# Altium project btalti.PrjPCB
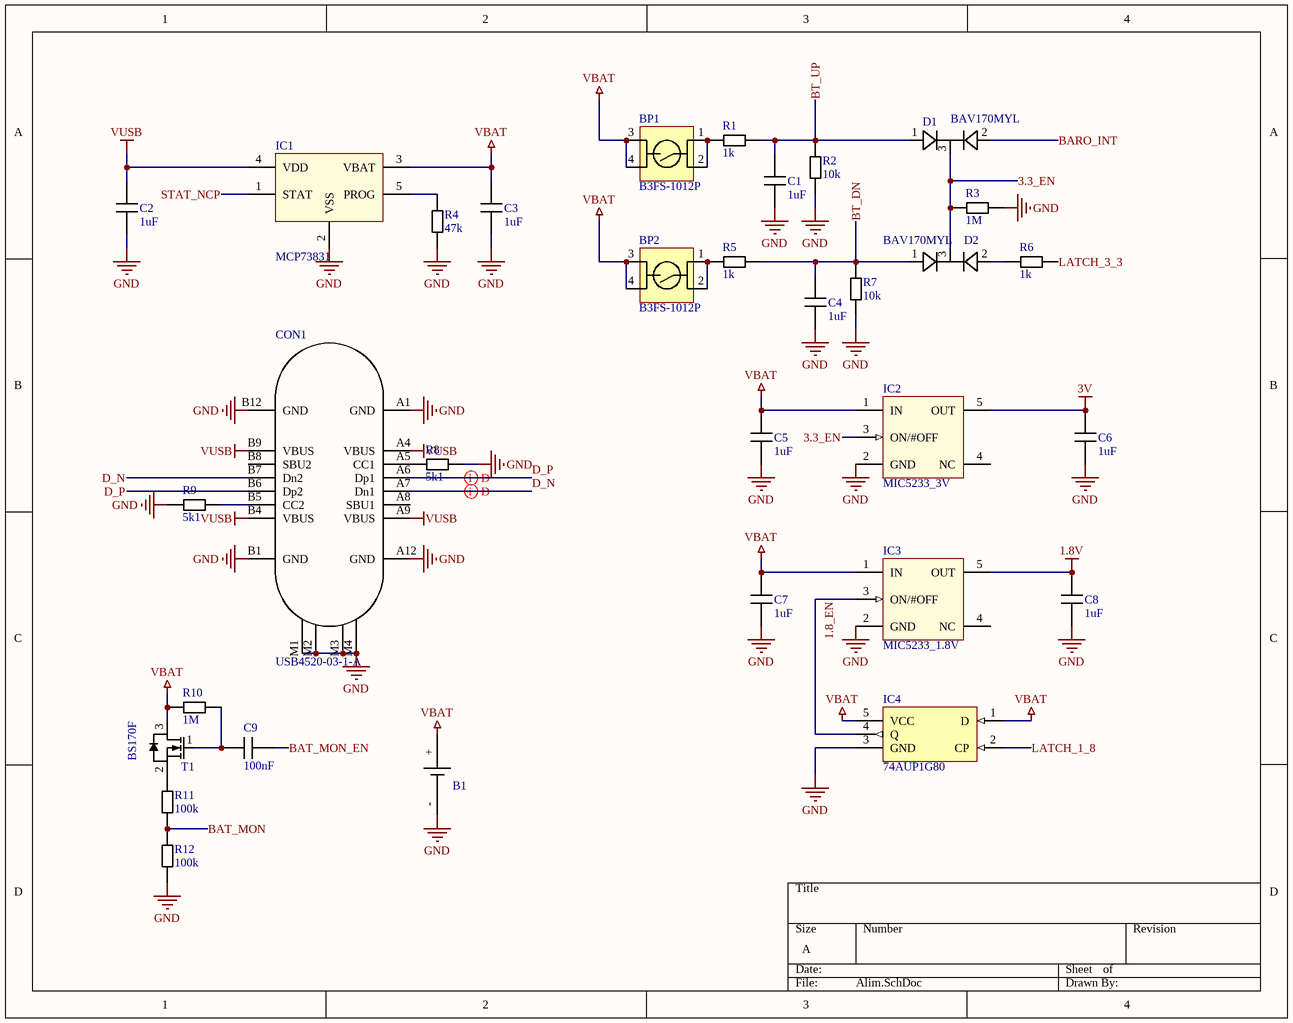
[diagram p0: Alim.SchDoc]
5 sheets, 99 parts. Net scope: global (net labels, ports and power ports of the same name join across sheets).
Board file: BT_ALTI.PcbDoc
Sheets:
  Alim.SchDoc
  Micro.SchDoc
  beep.SchDoc
  baro.SchDoc
  epd.SchDoc

## Sheet Alim.SchDoc
size A; SheetNumber: 1; SheetTotal: 3

### Parts
B1  EC382704P-T  [EC382704P-T]  (value not drawn)
BP1  B3FS-1012P  [B3FS]
BP2  B3FS-1012P  [B3FS]
C1  value 1uF  [C0402]  (hidden comment: 1uF (0402) AEC-Q200)
C2  value 1uF  [C0402]  (hidden comment: 1uF (0402) AEC-Q200)
C3  value 1uF  [C0402]  (hidden comment: 1uF (0402) AEC-Q200)
C4  value 1uF  [C0402]  (hidden comment: 1uF (0402) AEC-Q200)
C5  value 1uF  [C0402]  (hidden comment: 1uF (0402) AEC-Q200)
C6  value 1uF  [C0402]  (hidden comment: 1uF (0402) AEC-Q200)
C7  value 1uF  [C0402]  (hidden comment: 1uF (0402) AEC-Q200)
C8  value 1uF  [C0402]  (hidden comment: 1uF (0402) AEC-Q200)
C9  value 100nF  [C0402]  (hidden comment: 100nF (0402) AEC-Q200)
CON1  USB4520-03-1-A  [USB4520-03-1-A]
D1  BAV170MYL  [DFN1006-3]
D2  BAV170MYL  [DFN1006-3]
IC1  MCP73831  [SOT23-5]
IC2  MIC5233_3V  [SOT23-5]
IC3  MIC5233_1.8V  [SOT23-5]
IC4  74AUP1G80  [TSSOP5]
R1  value 1k  [R0402]  (hidden comment: 1k (0402))
R2  value 10k  [R0402]  (hidden comment: 10k (0402))
R3  value 1M  [R0402]  (hidden comment: 1M (0402))
R4  value 47k  [R0402]  (hidden comment: 47k (0402))
R5  value 1k  [R0402]  (hidden comment: 1k (0402))
R6  value 1k  [R0402]  (hidden comment: 1k (0402))
R7  value 10k  [R0402]  (hidden comment: 10k (0402))
R8  value 5k1  [R0402]  (hidden comment: 5k1 (0402) AEC-Q200)
R9  value 5k1  [R0402]  (hidden comment: 5k1 (0402) AEC-Q200)
R10  value 1M  [R0402]  (hidden comment: 1M (0402))
R11  value 100k  [R0402]  (hidden comment: 100k (0402))
R12  value 100k  [R0402]  (hidden comment: 100k (0402))
T1  BS170F  [SOT-23-3]

### Nets
1.8V: C8.1 IC3.5(OUT)
3V: C6.1 IC2.5(OUT)
GND: B1.- C1.2 C2.2 C3.2 C4.2 C5.2 C6.2 C7.2 C8.2 CON1.A1(GND) CON1.A12(GND) CON1.B1(GND) CON1.B12(GND) CON1.M1 CON1.M2 CON1.M3 CON1.M4 IC1.2(VSS) IC2.2(GND) IC3.2(GND) IC4.3(GND) R2.1 R3.1 R4.1 R7.1 R8.2 R9.1 R12.1
VBAT: B1.+ BP1.3 BP1.4 BP2.3 BP2.4 C3.1 C5.1 C7.1 IC1.3(VBAT) IC2.1(IN) IC3.1(IN) IC4.1(D) IC4.5(VCC) R10.1 T1.3(D)
VUSB: C2.1 CON1.A4(VBUS) CON1.A9(VBUS) CON1.B4(VBUS) CON1.B9(VBUS) IC1.4(VDD)
3.3_EN: D1.3(K1/A2) D2.3(K1/A2) IC2.3(ON/#OFF) R3.2
BARO_INT: D1.2(K2)
BAT_MON: R11.1 R12.2
BAT_MON_EN: C9.1
BT_DN: C4.1 D2.1(A1) R5.2 R7.2
BT_UP: C1.1 D1.1(A1) R1.2 R2.2
D_N: CON1.A7(Dn1) CON1.B7(Dn2)
D_P: CON1.A6(Dp1) CON1.B6(Dp2)
LATCH_1_8: IC4.2(CP)
LATCH_3_3: R6.2
STAT_NCP: IC1.1(STAT)
NetBP1_1: BP1.1 BP1.2 R1.1
NetBP2_1: BP2.1 BP2.2 R5.1
NetC9_2: C9.2 R10.2 T1.1(G)
NetCON1_A5: CON1.A5(CC1) R8.1
NetCON1_B5: CON1.B5(CC2) R9.2
NetD2_2: D2.2(K2) R6.1
NetIC1_5: IC1.5(PROG) R4.2
NetIC3_3: IC3.3(ON/#OFF) IC4.4(Q)
NetR11_2: R11.2 T1.2(S)

Not connected (* = marked no-connect by the designer): CON1 A8(SBU1) B8(SBU2); IC2 4(NC); IC3 4(NC)

### Layout directives
differential pair: D_N, D_P

### Notes on the sheet
- Labels drawn without touching a wire or pin: 1.8_EN

### Library data of the parts
B1 = EC382704P-T: 2.3V 25mAh Li-ion; Fabricant: NGH; Référence: EC382704P-T; Value: EC382704P-T
BP1 BP2 = B3FS-1012P: Fabricant: Omron; Référence: B3FS-1012P; Value: B3FS-1012P
C1-C8 = 1uF (0402) AEC-Q200: X7S 10% 0402 10V AEC-Q200; Fabricant: Murata; Référence: GCM155C71A105KE38D
C9 = 100nF (0402) AEC-Q200: X7R 0402 10% 50V AEC-Q200; Référence: GCM155R71H104KE02J; Fabricant: MURATA
CON1 = USB4520-03-1-A: Connecteur USB-C Receptacke mid PCB; Fabricant: GCT; Référence: USB4520-03-1-A; Value: USB4520-03-1-A
D1 D2 = BAV170MYL: Diodes - General Purpose, Power, Switching BAV170M/SOT883/XQFN3; Fabricant: Nexperia; Référence: BAV170MYL; Value: BAV170MYL
IC1 = MCP73831: Chargeur Li-Ion/Li-Polymer; Référence: MCP73831T-2ACI/OT; Fabricant: *; Value: MCP73831
IC2 = MIC5233_3V: 3V || SOT23 || 100mA || IN : 2.3V to 36V; Fabricant: Microchip Technology; Référence: MIC5233-3.0YM5-TR; Value: MIC5233_3V
IC3 = MIC5233_1.8V: 1.8V || SOT23 || 100mA || IN : 2.3V to 36V; Fabricant: Microchip Technology; Référence: MIC5233-1.8YM5-TR; Value: MIC5233_1.8V
IC4 = 74AUP1G80: Low-power D-type flip-flop; positive-edge trigger TSSOP5; Fabricant: NEXPERIA; Référence: 74AUP1G80GW; Value: 74AUP1G80
R1 R5 R6 = 1k (0402): 1% 0402 0.063W 100ppm; Fabricant: MULTICOMP; Référence: MCWR04X1001FTL
R2 R7 = 10k (0402): 1% 0402 0.063W 100ppm; Référence: MCWR04X1002FTL; Fabricant: MULTICOMP
R3 R10 = 1M (0402): 1% 0402 0.063W 100ppm; Fabricant: MULTICOMP; Référence: MCWR04X1004FTL
R4 = 47k (0402): 1% 0402 0.063W 100ppm; Fabricant: MULTICOMP; Référence: MCWR04X4702FTL
R8 R9 = 5k1 (0402) AEC-Q200: 1% 0402 0.1W 100ppm AEC-Q200; Référence: ERJ-2RKF5101X; Fabricant: PANASONIC
R11 R12 = 100k (0402): 1% 0402  0.063W 100ppm; Fabricant: MULTICOMP; Référence: MCWR04X1003FTL
T1 = BS170F: N-MOS || SOT23 60V 150mA; Fabricant: Diodes Inc.; Référence: BS170F; Supplier: Farnell; RefSupplier: 9526005; Value: BS170F

## Sheet Micro.SchDoc
size A; SheetNumber: 2; SheetTotal: 3
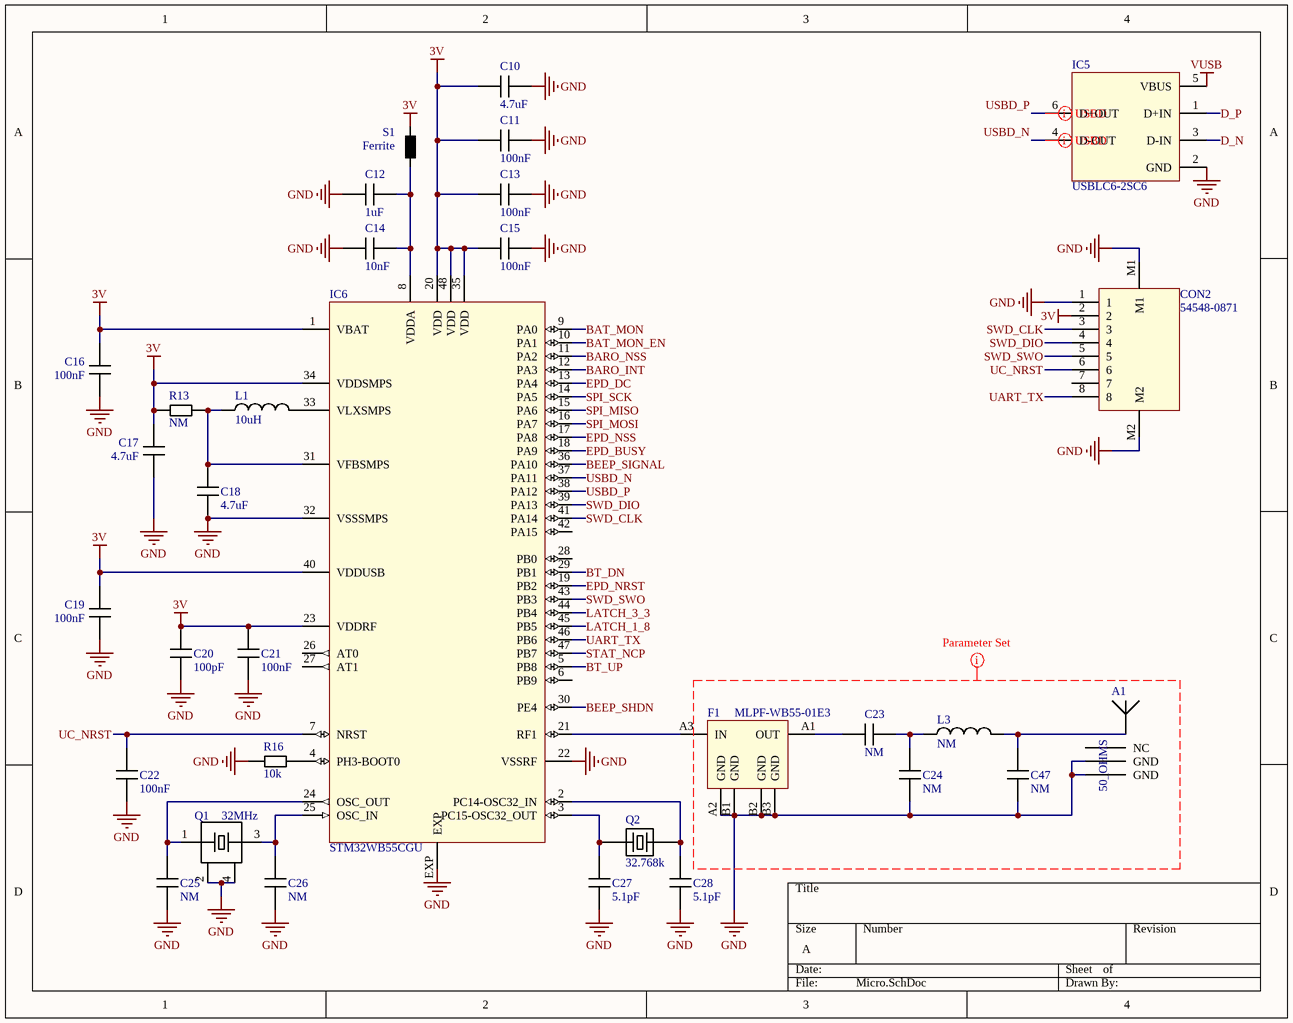
[diagram p1: Micro.SchDoc]

### Parts
A1  value 50_OHMS  [2450AT42E0100]  (hidden comment: 2450AT42E0100)
C10  value 4.7uF  [C0402]  (hidden comment: 4.7uF (0402) AEC-Q200)
C11  value 100nF  [C0402]  (hidden comment: 100nF (0402) AEC-Q200)
C12  value 1uF  [C0402]  (hidden comment: 1uF (0402))
C13  value 100nF  [C0402]  (hidden comment: 100nF (0402) AEC-Q200)
C14  value 10nF  [C0402]  (hidden comment: 10nF (0402) AEC-Q200)
C15  value 100nF  [C0402]  (hidden comment: 100nF (0402) AEC-Q200)
C16  value 100nF  [C0402]  (hidden comment: 100nF (0402) AEC-Q200)
C17  value 4.7uF  [C0402]  (hidden comment: 4.7uF (0402) AEC-Q200)
C18  value 4.7uF  [C0402]  (hidden comment: 4.7uF (0402) AEC-Q200)
C19  value 100nF  [C0402]  (hidden comment: 100nF (0402) AEC-Q200)
C20  value 100pF  [C0402]  (hidden comment: 100pF (0402) AEC-Q200)
C21  value 100nF  [C0402]  (hidden comment: 100nF (0402) AEC-Q200)
C22  value 100nF  [C0402]  (hidden comment: 100nF (0402) AEC-Q200)
C23  value NM  [C0402 (NM)]  (hidden comment: NM (0402))
C24  value NM  [C0402 (NM)]  (hidden comment: NM (0402))
C25  value NM  [C0402 (NM)]  (hidden comment: NM (0402))
C26  value NM  [C0402 (NM)]  (hidden comment: NM (0402))
C27  value 5.1pF  [C0402]  (hidden comment: 5.1pF (0402) AEC-Q200)
C28  value 5.1pF  [C0402]  (hidden comment: 5.1pF (0402) AEC-Q200)
C47  value NM  [C0402 (NM)]  (hidden comment: NM (0402))
CON2  54548-0871  [54548-0871]
F1  MLPF-WB55-01E3  [MLPF-WB-01E3]
IC5  value USBLC6-2SC6  [SOT23-6]  (hidden comment: USBLC6-2)
IC6  STM32WB55CGU  [UFQFPN48]
L1  value 10uH  [2.5x2 (2512)]  (hidden comment: 10uH (2.5x2) AEC-Q200)
L3  value NM  [S0402 (NM)]  (hidden comment: NM (0402))
Q1  value 32MHz  [2.0x1.6 - ECS-320-8-47Q]  (hidden comment: ECS-320-8-47Q-CES-TR)
Q2  value 32.768k  [3.2x1.5]  (hidden comment: ECS-.327-12.5-34QCS-TR)
R13  value NM  [R0402 (NM)]  (hidden comment: NM (0402))
R16  value 10k  [R0402]  (hidden comment: 10k (0402) AEC-Q200)
S1  value Ferrite  [0402 (FERRITE)]  (hidden comment: Ferrite (0402) 1k AEC-Q200)

### Nets
3V: C10.2 C11.1 C13.1 C15.1 C16.1 C17.2 C19.1 C20.1 C21.1 CON2.2 IC6.1(VBAT) IC6.20(VDD) IC6.23(VDDRF) IC6.34(VDDSMPS) IC6.35(VDD) IC6.40(VDDUSB) IC6.48(VDD) R13.1 S1.2
GND: A1.3(GND) A1.4(GND) C10.1 C11.2 C12.1 C13.2 C14.2 C15.2 C16.2 C17.1 C18.1 C19.2 C20.2 C21.2 C22.2 C24.2 C25.2 C26.2 C27.2 C28.2 C47.2 CON2.1 CON2.M1 CON2.M2 F1.A2(GND) F1.B1(GND) F1.B2(GND) F1.B3(GND) IC5.2(GND) IC6.22(VSSRF) IC6.32(VSSSMPS) IC6.EXP Q1.2 Q1.4 R16.1
VUSB: IC5.5(VBUS)
BARO_INT: IC6.12(PA3)
BARO_NSS: IC6.11(PA2)
BAT_MON: IC6.9(PA0)
BAT_MON_EN: IC6.10(PA1)
BEEP_SHDN: IC6.30(PE4)
BEEP_SIGNAL: IC6.36(PA10)
BT_DN: IC6.29(PB1)
BT_UP: IC6.5(PB8)
D_N: IC5.3(D-IN)
D_P: IC5.1(D+IN)
EPD_BUSY: IC6.18(PA9)
EPD_DC: IC6.13(PA4)
EPD_NRST: IC6.19(PB2)
EPD_NSS: IC6.17(PA8)
LATCH_1_8: IC6.45(PB5)
LATCH_3_3: IC6.44(PB4)
SPI_MISO: IC6.15(PA6)
SPI_MOSI: IC6.16(PA7)
SPI_SCK: IC6.14(PA5)
STAT_NCP: IC6.47(PB7)
SWD_CLK: CON2.3 IC6.41(PA14)
SWD_DIO: CON2.4 IC6.39(PA13)
SWD_SWO: CON2.5 IC6.43(PB3)
UART_TX: CON2.8 IC6.46(PB6)
UC_NRST: C22.1 CON2.6 IC6.7(NRST)
USBD_N: IC5.4(D-OUT) IC6.37(PA11)
USBD_P: IC5.6(D+OUT) IC6.38(PA12)
NetA1_1: A1.1 C47.1 L3.2
NetC12_2: C12.2 C14.1 IC6.8(VDDA) S1.1
NetC18_2: C18.2 IC6.31(VFBSMPS) L1.1 R13.2
NetC23_1: C23.1 F1.A1(OUT)
NetC23_2: C23.2 C24.1 L3.1
NetC25_1: C25.1 IC6.24(OSC_OUT) Q1.1(NC)
NetC26_1: C26.1 IC6.25(OSC_IN) Q1.3(GND)
NetC27_1: C27.1 IC6.3(PC15-OSC32_OUT) Q2.1
NetC28_1: C28.1 IC6.2(PC14-OSC32_IN) Q2.2
NetF1_A3: F1.A3(IN) IC6.21(RF1)
NetIC6_4: IC6.4(PH3-BOOT0) R16.2
NetIC6_33: IC6.33(VLXSMPS) L1.2

Not connected (* = marked no-connect by the designer): A1 2(NC); CON2 7; IC6 6(PB9) 26(AT0) 27(AT1) 28(PB0) 42(PA15)

### Layout directives
differential pair: USBD_N, USBD_P
net class RF; CompClassName: RF: (no net found under the mark)

### Library data of the parts
A1 = 2450AT42E0100: RF ANT 900MHZ HELICAL SOLDER SMD; Fabricant: PulseLarsen Antennas; Référence: 2450AT42E0100
C10 C17 C18 = 4.7uF (0402) AEC-Q200: X7T 0402 10% 6.3V AEC-Q200; Référence: KAM05CT70J475KH; Fabricant: KYOCERA AVX
C11 C13 C15 C16 C19 C21 C22 = 100nF (0402) AEC-Q200: as C9 on sheet Alim
C12 = 1uF (0402): X7S 10% 0402 16V; Fabricant: MURATA; Référence: GRM155C71C105KE11D
C14 = 10nF (0402) AEC-Q200: X7R 0402 10% 50V AEC-Q200; Fabricant: MURATA; Référence: GRT155R71H103KE01D
C20 = 100pF (0402) AEC-Q200: NP0 0402 5% 50V AEC-Q200; Référence: GCM1555C1H101JA16D; Fabricant: MURATA
C27 C28 = 5.1pF (0402) AEC-Q200: NP0 0402 5% 50V AEC-Q200; Fabricant: MURATA; Référence: GCM1555C1H5R1CA16D
CON2 = 54548-0871: Connecteur FFC/FPC, Right-Angle, Surface Mount, ZIF, Bottom Contact / Style, 30 Circuits; Fabricant: MOLEX; Référence: 54548-0871; Value: 54548-0871
F1 = MLPF-WB55-01E3: 2.4 GHz low pass filter matched to STM32WB55C; Fabricant: ST; Référence: MLPF-WB55-01E3; Value: MLPF-WB55-01E3
IC5 = USBLC6-2: Fabricant: ST; Référence: USBLC6-2SC6
IC6 = STM32WB55CGU: Fabricant: ST; Référence: STM32WB55CGU3; Value: STM32WB55CGU
L1 = 10uH (2.5x2) AEC-Q200: 20% 2.5x2 semi-blindé AEC-Q200; Fabricant: WURTH ELEKTRONIK; Référence: 74404024100; Supplier: Farnell; RefSupplier: 2431473
Q1 = ECS-320-8-47Q-CES-TR: Quartz 32MHz; Référence: ECS-320-10-37Q-ES-TR; Fabricant: ECS Inc.
Q2 = ECS-.327-12.5-34QCS-TR: Cristal, 32.768 kHz, CMS, 3.2mm x 1.5mm AEC-Q200; Fabricant: ECS; Référence: ECS-.327-12.5-34QCS-TR
R16 = 10k (0402) AEC-Q200: 1% 0402 0.1W 100ppm AEC-Q200; Référence: ERJ-2RKF1002X; Fabricant: PANASONIC
S1 = Ferrite (0402) 1k AEC-Q200: Perle de ferrite AEC-Q200; Fabricant: TDK; Référence: MMZ1005Y102CTD25

## Sheet beep.SchDoc
size A4
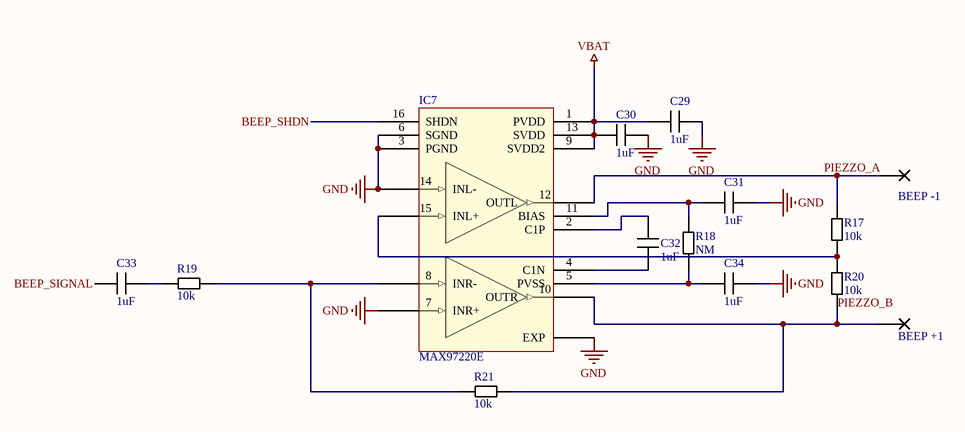
[diagram p2: beep.SchDoc]

### Parts
BEEP_+1  hole_0.8/0.5  [0.8 / 0.5]  (value not drawn)
BEEP_-1  hole_0.8/0.5  [0.8 / 0.5]  (value not drawn)
C29  value 1uF  [C0402]  (hidden comment: 1uF (0402))
C30  value 1uF  [C0402]  (hidden comment: 1uF (0402))
C31  value 1uF  [C0402]  (hidden comment: 1uF (0402))
C32  value 1uF  [C0402]  (hidden comment: 1uF (0402))
C33  value 1uF  [C0402]  (hidden comment: 1uF (0402))
C34  value 1uF  [C0402]  (hidden comment: 1uF (0402))
IC7  MAX97220E  [TQFN-16]
R17  value 10k  [R0402]  (hidden comment: 10k (0402))
R18  value NM  [R0402 (NM)]  (hidden comment: NM (0402))
R19  value 10k  [R0402]  (hidden comment: 10k (0402))
R20  value 10k  [R0402]  (hidden comment: 10k (0402))
R21  value 10k  [R0402]  (hidden comment: 10k (0402))

### Nets
GND: C29.2 C30.2 C31.2 C34.2 IC7.3(PGND) IC7.6(SGND) IC7.7(INR+) IC7.14(INL-) IC7.EXP
VBAT: C29.1 C30.1 IC7.1(PVDD) IC7.9(SVDD2) IC7.13(SVDD)
BEEP_SHDN: IC7.16(SHDN)
BEEP_SIGNAL: C33.1
PIEZZO_A: BEEP_-1.1 IC7.12(OUTL) R17.2
PIEZZO_B: BEEP_+1.1 IC7.10(OUTR) R20.1 R21.1
NetC31_1: C31.1 IC7.11(BIAS) R18.2
NetC32_1: C32.1 IC7.2(C1P)
NetC32_2: C32.2 IC7.4(C1N)
NetC33_2: C33.2 R19.2
NetC34_1: C34.1 IC7.5(PVSS) R18.1
NetIC7_8: IC7.8(INR-) R19.1 R21.2
NetIC7_15: IC7.15(INL+) R17.1 R20.2

### Library data of the parts
C29-C34 = 1uF (0402): as C12 on sheet Micro
IC7 = MAX97220E: Differential Input DirectDrive / Line Drivers/Headphone Amplifiers; Fabricant: Maxim Integrated; Value: MAX97220E; Référence: MAX97220E
R17 R19-R21 = 10k (0402): as R2 on sheet Alim
BEEP_+1 BEEP_-1 = hole_0.8/0.5: Value: *

## Sheet baro.SchDoc
size A4
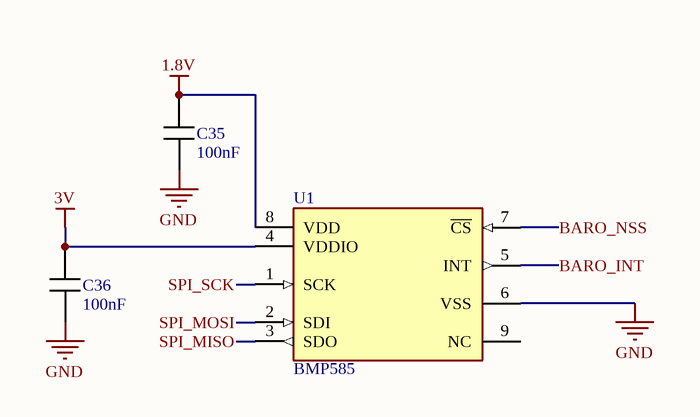
[diagram p3: baro.SchDoc]

### Parts
C35  value 100nF  [C0402]  (hidden comment: 100nF (0402) AEC-Q200)
C36  value 100nF  [C0402]  (hidden comment: 100nF (0402) AEC-Q200)
U1  BMP585  [BM585]

### Nets
1.8V: C35.2 U1.8(VDD)
3V: C36.2 U1.4(VDDIO)
GND: C35.1 C36.1 U1.6(VSS)
BARO_INT: U1.5(INT)
BARO_NSS: U1.7(~{CS})
SPI_MISO: U1.3(SDO)
SPI_MOSI: U1.2(SDI)
SPI_SCK: U1.1(SCK)

Not connected (* = marked no-connect by the designer): U1 9(NC)

### Library data of the parts
C35 C36 = 100nF (0402) AEC-Q200: as C9 on sheet Alim
U1 = BMP585: Absolute Pressure Sensor 1.65 to 3.6 V SPI -WFLGA-10; Fabricant: Bosch Sensortec; Value: BMP585; Référence: BMP585

## Sheet epd.SchDoc
size A; SheetNumber: 3; SheetTotal: 3
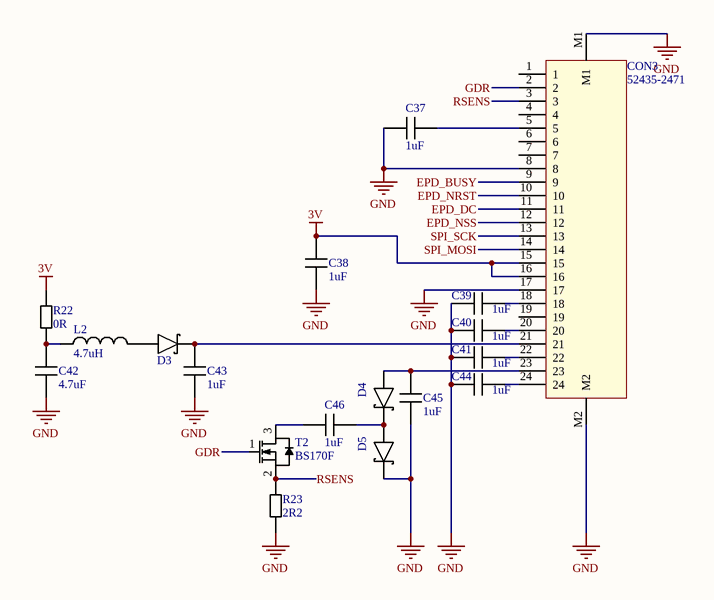
[diagram p4: epd.SchDoc]

### Parts
C37  value 1uF  [C0402]  (hidden comment: 1uF (0402) AEC-Q200 HT)
C38  value 1uF  [C0402]  (hidden comment: 1uF (0402) AEC-Q200 HT)
C39  value 1uF  [C0402]  (hidden comment: 1uF (0402) AEC-Q200 HT)
C40  value 1uF  [C0402]  (hidden comment: 1uF (0402) AEC-Q200 HT)
C41  value 1uF  [C0402]  (hidden comment: 1uF (0402) AEC-Q200 HT)
C42  value 4.7uF  [C0402]  (hidden comment: 4.7uF (0402) AEC-Q200)
C43  value 1uF  [C0402]  (hidden comment: 1uF (0402) AEC-Q200 HT)
C44  value 1uF  [C0402]  (hidden comment: 1uF (0402) AEC-Q200 HT)
C45  value 1uF  [C0402]  (hidden comment: 1uF (0402) AEC-Q200 HT)
C46  value 1uF  [C0402]  (hidden comment: 1uF (0402) AEC-Q200 HT)
CON3  52435-2471  [52435-2471]
D3  Schottky (0402) AEC-Q101  [SOD-882 (0402)]  (value not drawn)
D4  Schottky (0402) AEC-Q101  [SOD-882 (0402)]  (value not drawn)
D5  Schottky (0402) AEC-Q101  [SOD-882 (0402)]  (value not drawn)
L2  value 4.7uH  [S0603]  (hidden comment: 4.7uH (0603))
R22  value 0R  [R0402]  (hidden comment: 0R (0402) AEC-Q200)
R23  value 2R2  [R0402]  (hidden comment: 2R2 (0402))
T2  BS170F  [SOT-23-3]

### Nets
3V: C38.1 CON3.15 CON3.16 R22.2
GND: C37.1 C38.2 C39.2 C40.2 C41.2 C42.2 C43.2 C44.2 C45.2 CON3.8 CON3.17 CON3.M1 CON3.M2 D5.K R23.1
EPD_BUSY: CON3.9
EPD_DC: CON3.11
EPD_NRST: CON3.10
EPD_NSS: CON3.12
GDR: CON3.2 T2.1(G)
RSENS: CON3.3 R23.2 T2.2(S)
SPI_MOSI: CON3.14
SPI_SCK: CON3.13
NetC37_2: C37.2 CON3.5
NetC39_1: C39.1 CON3.18
NetC40_1: C40.1 CON3.20
NetC41_1: C41.1 CON3.22
NetC42_1: C42.1 L2.1 R22.1
NetC43_1: C43.1 CON3.21 D3.K
NetC44_1: C44.1 CON3.24
NetC45_1: C45.1 CON3.23 D4.A
NetC46_1: C46.1 T2.3(D)
NetC46_2: C46.2 D4.K D5.A
NetD3_A: D3.A L2.2

Not connected (* = marked no-connect by the designer): CON3 1 4 6 7 19

### Library data of the parts
C37-C41 C43-C46 = 1uF (0402) AEC-Q200 HT: X6S 10% 0402 25V AEC-Q200; Fabricant: Murata; Référence: GRT155C81E105KE13D
C42 = 4.7uF (0402) AEC-Q200: as C10 on sheet Micro
CON3 = 52435-2471: Connecteur FFC/FPC, Right-Angle, Surface Mount, ZIF, Top Contact / Style, 24 Circuits; Fabricant: MOLEX; Référence: 52435-2471; Value: 52435-2471
D3-D5 = Schottky (0402) AEC-Q101: 0402 40V 0.2A AEC-Q101; Fabricant: NEXPERIA; Référence: PMEG4002EL,315; Value: Schottky
L2 = 4.7uH (0603): 20% 0603 blindé; Fabricant: COILCRAFT; Référence: PFL1609-472MEU
R22 = 0R (0402) AEC-Q200: 0.1% 0402 0.1W AEC-Q200; Référence: ERJ-U020R00X; Fabricant: PANASONIC
R23 = 2R2 (0402): 1% 0402 0.1W 100ppm; Fabricant: YAGEO; Référence: AC0402FR-072R2L
T2 = BS170F: as T1 on sheet Alim; Référence: BS170F; Supplier: Farnell; RefSupplier: 9526005; Value: BS170F

## Nets that join several sheets
1.8V: Alim (C8.1 IC3.5), baro (C35.2 U1.8)
3V: Alim (C6.1 IC2.5), Micro (19 pins), baro (C36.2 U1.4), epd (C38.1 CON3.15 CON3.16 R22.2)
GND: Alim (28 pins), Micro (35 pins), beep (9 pins), baro (C35.1 C36.1 U1.6), epd (15 pins)
VBAT: Alim (15 pins), beep (5 pins)
VUSB: Alim (6 pins), Micro (IC5.5)
BARO_INT: Alim (D1.2), Micro (IC6.12), baro (U1.5)
BARO_NSS: Micro (IC6.11), baro (U1.7)
BAT_MON: Alim (R11.1 R12.2), Micro (IC6.9)
BAT_MON_EN: Alim (C9.1), Micro (IC6.10)
BEEP_SHDN: Micro (IC6.30), beep (IC7.16)
BEEP_SIGNAL: Micro (IC6.36), beep (C33.1)
BT_DN: Alim (C4.1 D2.1 R5.2 R7.2), Micro (IC6.29)
BT_UP: Alim (C1.1 D1.1 R1.2 R2.2), Micro (IC6.5)
D_N: Alim (CON1.A7 CON1.B7), Micro (IC5.3)
D_P: Alim (CON1.A6 CON1.B6), Micro (IC5.1)
EPD_BUSY: Micro (IC6.18), epd (CON3.9)
EPD_DC: Micro (IC6.13), epd (CON3.11)
EPD_NRST: Micro (IC6.19), epd (CON3.10)
EPD_NSS: Micro (IC6.17), epd (CON3.12)
LATCH_1_8: Alim (IC4.2), Micro (IC6.45)
LATCH_3_3: Alim (R6.2), Micro (IC6.44)
SPI_MISO: Micro (IC6.15), baro (U1.3)
SPI_MOSI: Micro (IC6.16), baro (U1.2), epd (CON3.14)
SPI_SCK: Micro (IC6.14), baro (U1.1), epd (CON3.13)
STAT_NCP: Alim (IC1.1), Micro (IC6.47)